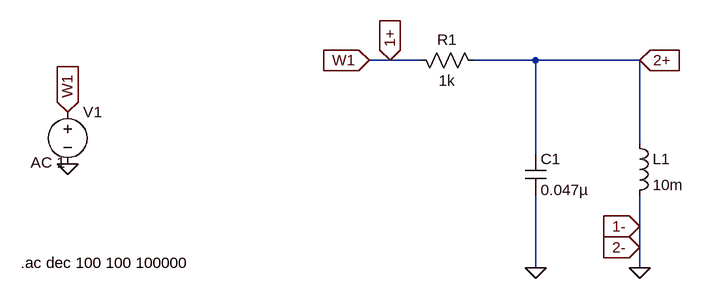
[diagram p0: schematic bpf_ltspice.asc]
bpf_ltspice.asc, the LTspice schematic file:
Version 4
SHEET 1 880 680
WIRE 32 32 0 32
WIRE 80 32 32 32
WIRE 256 32 160 32
WIRE 416 32 256 32
WIRE 416 160 416 32
WIRE 256 176 256 32
WIRE 416 288 416 240
WIRE 416 320 416 288
WIRE 256 352 256 240
WIRE 416 352 416 320
FLAG -464 192 0
FLAG -464 112 W1
IOPIN -464 112 In
FLAG 0 32 W1
IOPIN 0 32 In
FLAG 32 32 1+
IOPIN 32 32 In
FLAG 416 32 2+
IOPIN 416 32 In
FLAG 416 288 1-
IOPIN 416 288 In
FLAG 416 320 2-
IOPIN 416 320 In
FLAG 416 352 0
FLAG 256 352 0
SYMBOL res 64 16 M90
WINDOW 0 0 56 VBottom 2
WINDOW 3 32 56 VTop 2
SYMATTR InstName R1
SYMATTR Value 1k
SYMBOL cap 240 176 R0
SYMATTR InstName C1
SYMATTR Value 0.047µ
SYMBOL voltage -464 96 R0
WINDOW 123 -57 93 Left 2
WINDOW 39 0 0 Left 0
SYMATTR Value2 AC 1
SYMATTR InstName V1
SYMATTR Value ""
SYMBOL ind 400 144 R0
SYMATTR InstName L1
SYMATTR Value 10m
TEXT -536 344 Left 2 !.ac dec 100 100 100000

The netlist it stands for:
* bpf_ltspice.asc
R1 1+ 2+ 1k
C1 2+ 0 0.047µ
V1 1+ 0 AC 1
L1 2+ 0 10m
.ac dec 100 100 100000
.backanno
.end